# EAGLE design Esquematico (EAGLE 9.6.2)
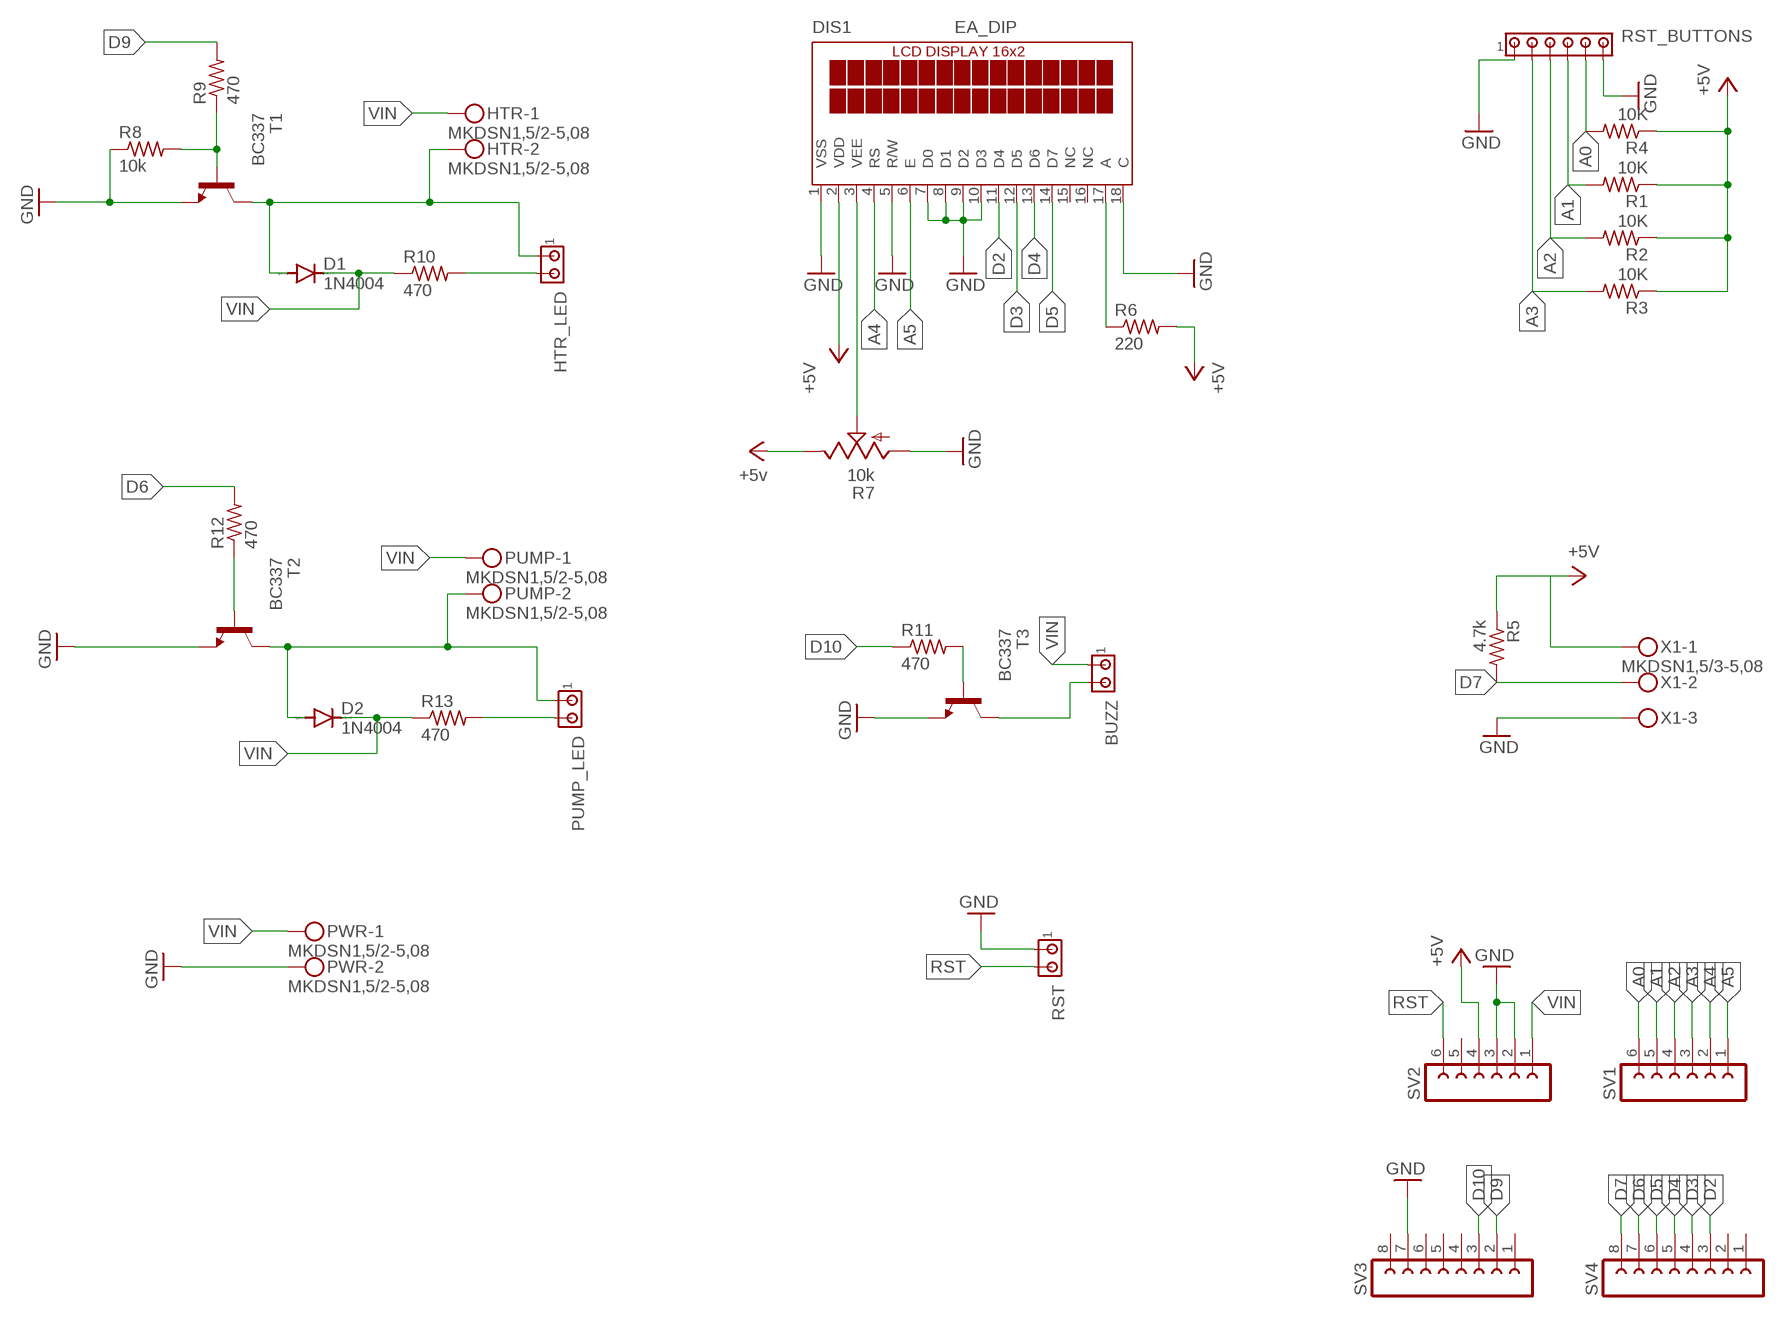
[diagram p0: schematic, sheet 1]

## Parts
BUZZ  MTA02-100  [10X02MTA]
D1  1N4004  [DO41-10]
D2  1N4004  [DO41-10]
DIS1  EA_DIP  [EA_DIP]
HTR  MKDSN1,5/2-5,08  [MKDSN1,5/2-5,08]
HTR_LED  MTA02-100  [10X02MTA]
PUMP  MKDSN1,5/2-5,08  [MKDSN1,5/2-5,08]
PUMP_LED  MTA02-100  [10X02MTA]
PWR  MKDSN1,5/2-5,08  [MKDSN1,5/2-5,08]
R1  10K  R-US_0204/5  [0204/5]
R2  10K  R-US_0204/5  [0204/5]
R3  10K  R-US_0204/5  [0204/5]
R4  10K  R-US_0204/5  [0204/5]
R5  4.7k  R-US_0204/5  [0204/5]
R6  220  R-US_0204/5  [0204/5]
R7  10k  TRIM_US-B25P  [B25P]
R8  10k  R-US_0204/5  [0204/5]
R9  470  R-US_0204/5  [0204/5]
R10  470  R-US_0204/5  [0204/5]
R11  470  R-US_0204/5  [0204/5]
R12  470  R-US_0204/5  [0204/5]
R13  470  R-US_0204/5  [0204/5]
RST  MTA02-100  [10X02MTA]
RST_BUTTONS  MTA06-100  [10X06MTA]
SV1  FE06-1  [FE06]
SV2  FE06-1  [FE06]
SV3  FE08-1  [FE08]
SV4  FE08-1  [FE08]
T1  BC337  [TO92]
T2  BC337  [TO92]
T3  BC337  [TO92]
X1  MKDSN1,5/3-5,08  [MKDSN1,5/3-5,08]

## Nets
A0: R4.2 RST_BUTTONS.5 SV1.6
A1: R1.2 RST_BUTTONS.4 SV1.5
A2: R2.2 RST_BUTTONS.3 SV1.4
A3: R3.2 RST_BUTTONS.2 SV1.3
A4: DIS1.4(RS) SV1.2
A5: DIS1.6(E) SV1.1
D2: DIS1.11(D4) SV4.3
D3: DIS1.12(D5) SV4.4
D4: DIS1.13(D6) SV4.5
D5: DIS1.14(D7) SV4.6
D6: R12.2 SV4.7
D7: R5.2 SV4.8 X1.2
D9: R9.2 SV3.2
D10: R11.1 SV3.3
GND: DIS1.1(VSS) DIS1.5(R/W) DIS1.7(D0) DIS1.8(D1) DIS1.9(D2) DIS1.10(D3) DIS1.18(C) PWR.2 R7.A R8.1 RST.1 RST_BUTTONS.1 RST_BUTTONS.6 SV2.2 SV2.3 SV3.7 T1.1(E) T2.1(E) T3.1(E) X1.3
N$1: DIS1.3(VEE) R7.S
N$2: R12.1 T2.2(B)
N$3: R8.2 R9.1 T1.2(B)
N$4: DIS1.17(A) R6.1
N$5: D1.A HTR.2 HTR_LED.1 T1.3(C)
N$6: HTR_LED.2 R10.2
N$7: D2.A PUMP.2 PUMP_LED.1 T2.3(C)
N$8: PUMP_LED.2 R13.2
N$9: R11.2 T3.2(B)
N$10: BUZZ.2 T3.3(C)
RST: RST.2 SV2.6
VCC: DIS1.2(VDD) R1.1 R2.1 R3.1 R4.1 R5.1 R6.2 R7.E SV2.4 X1.1 ; supply symbol labelled +5V, +5v
VIN: BUZZ.1 D1.C D2.C HTR.1 PUMP.1 PWR.1 R10.1 R13.1 SV2.1
Unconnected: DIS1.15(NC) DIS1.16(NC) SV2.5 SV3.1 SV3.4 SV3.5 SV3.6 SV3.8 SV4.1 SV4.2

## Library data of the parts
BUZZ HTR_LED PUMP_LED RST = con-amp:MTA02-100: AMP connector
D1 D2 = diode:1N4004: DIODE general purpose rectifier, 1 A
DIS1 = display-lcd:EA_DIP: LCD-MODUL 2x16 - 6,68mm, INKL. KONTROLLER HD44780 Source: Data sheet <http://www.lcd-module.de/pdf/doma/dip162-d.pdf>
HTR PUMP PWR = con-phoenix-508:MKDSN1,5/2-5,08: MKDSN 1,5/ 2-5,08 Printklemme Nennstrom: 13,5 A Nennspannung: 250 V Rastermaß: 5,08 mm Polzahl: 2 Anschlussart: Schraubanschluss Montage: Löten Anschlussrichtung Leiter/Platine: 0 ° Artikelnummer: 1729128 Source: http://eshop.phoenixcontact.com .. 1729128.pdf
R1-R6 R8-R13 = rcl:R-US_: RESISTOR, American symbol; SPICEPREFIX: R
R7 = pot:TRIM_US-: POTENTIOMETER
RST_BUTTONS = con-amp:MTA06-100: AMP connector Connection corrected 2014-09-19
SV1 SV2 = con-lsta:FE06-1: FEMALE HEADER; OC_FARNELL: unknown; OC_NEWARK: unknown
SV3 SV4 = con-lsta:FE08-1: FEMALE HEADER; OC_FARNELL: unknown; OC_NEWARK: unknown
T1-T3 = transistor:BC337: NPN TRANSISTOR
X1 = con-phoenix-508:MKDSN1,5/3-5,08: MKDSN 1,5/ 3-5,08 Printklemme Nennstrom: 13,5 A Nennspannung: 250 V Rastermaß: 5,08 mm Polzahl: 3 Anschlussart: Schraubanschluss Montage: Löten Anschlussrichtung Leiter/Platine: 0 ° Artikelnummer: 1729131 Source: http://eshop.phoenixcontact.com .. 1729131.pdf

## Board
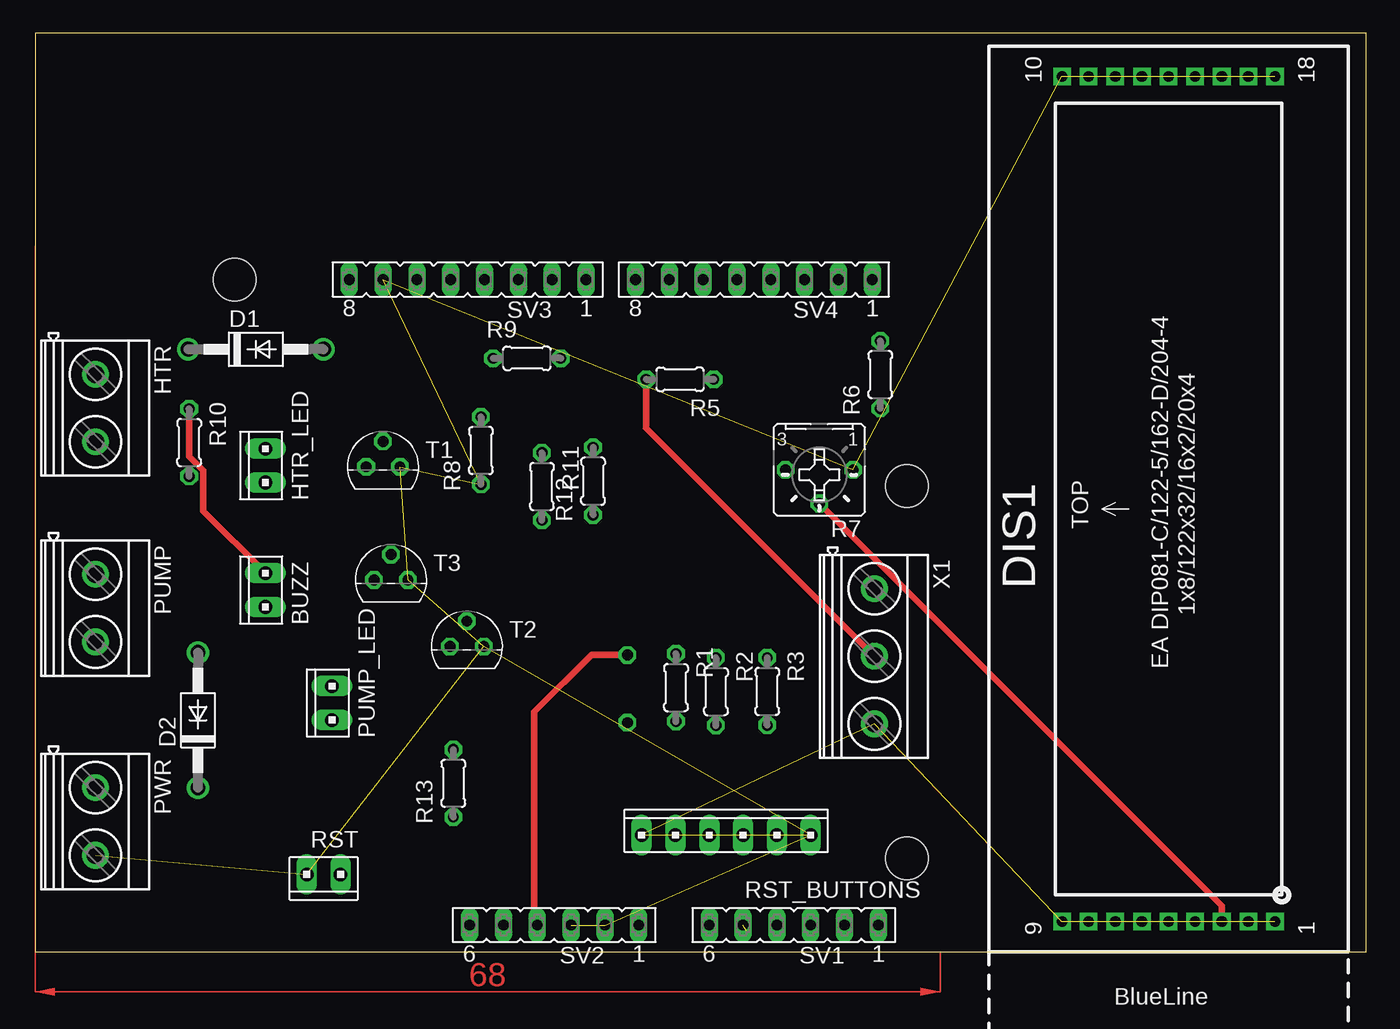
[diagram p1: board, top side]
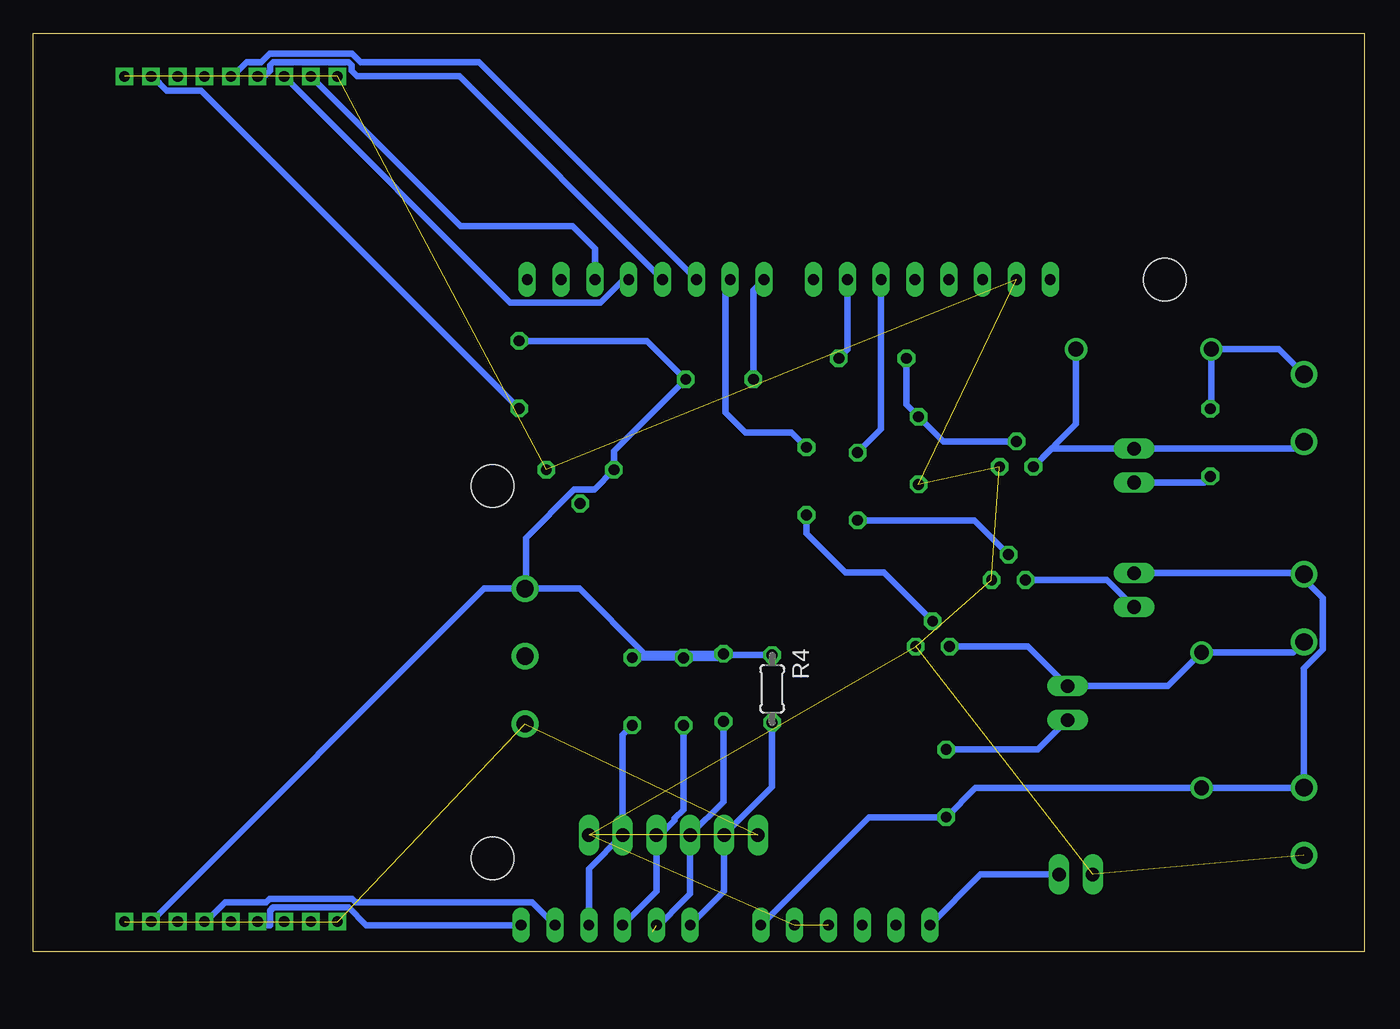
[diagram p2: board, bottom side, seen from below]

Size 100 x 69 mm. Coordinates in mm from the lower left corner, seen from the top.
Outline: 0,0 100,0 100,69 0,69 0,0
Copper layers (1*16): Top 0.035mm / dielectric 1.5mm / Bottom 0.035mm
Design rules "default": minimum track width 6mil, minimum drill 0.35mm, track to track 6mil, track to pad 6mil, pad to pad 6mil, via to via 6mil, smd to smd 6mil, copper to edge 40mil, drill to drill 6mil, minimum pad ring 10mil, minimum via ring 8mil, stop-mask expansion 4mil, vias tented up to drill 0mil, thermal gap 10mil
Holes 3.2 mm at 15,50.5 65.5,7 65.5,35

### Footprints (pad centres in the part's own frame; a part is rotated, then mirrored left to right if it is on the bottom)
10X02MTA = drill 1.016 long: 1 1.27,0; 2 -1.27,0
DO41-10 = drill 1.118: A 5.08,0; C -5.08,0
EA_DIP = drill 0.813 pad 1.27 square: 1 0,0; 2 0,2; 3 0,4; 4 0,6; 5 0,8; 6 0,10; 7 0,12; 8 0,14; 9 0,16; 10 63.5,16; 11 63.5,14; 12 63.5,12; 13 63.5,10; 14 63.5,8; 15 63.5,6; 16 63.5,4; 17 63.5,2; 18 63.5,0
MKDSN1,5/2-5,08 = drill 1.3 pad 2: 1 -2.561,0.025; 2 2.519,0.025
0204/5 = drill 0.813 octagon: 1 -2.54,0; 2 2.54,0
B25P = drill 0.813 octagon: A -2.54,0; E 2.54,0; S 0,2.54
10X06MTA = drill 1.016 long: 1 6.35,0; 2 3.81,0; 3 1.27,0; 4 -1.27,0; 5 -3.81,0; 6 -6.35,0
FE06 = drill 0.813 long: 1 -6.35,0; 2 -3.81,0; 3 -1.27,0; 4 1.27,0; 5 3.81,0; 6 6.35,0
FE08 = drill 0.813 long: 1 -8.89,0; 2 -6.35,0; 3 -3.81,0; 4 -1.27,0; 5 1.27,0; 6 3.81,0; 7 6.35,0; 8 8.89,0
TO92 = drill 0.813 octagon: 1 1.27,0; 2 0,1.905; 3 -1.27,0
MKDSN1,5/3-5,08 = drill 1.3 pad 2: 1 -7.641,0.025; 2 -2.561,0.025; 3 2.519,0.025

### Placement (x,y rotation side)
BUZZ  17.31,27.17 90 top
D1  16.59,45.26 0 top
D2  12.24,17.39 90 top
DIS1  93.15,2.26 90 top
HTR  4.52,40.82 270 top
HTR_LED  17.31,36.52 90 top
PUMP  4.52,25.79 270 top
PUMP_LED  22.31,18.68 90 top
PWR  4.52,9.76 270 top
R1  48.15,19.84 270 top
R2  51.15,19.54 270 top
R3  55,19.55 270 top
R4  44.5,19.75 270 bottom
R5  48.45,43 180 top
R6  63.5,43.35 90 top
R7  58.92,36.21 180 top
R8  33.5,37.65 90 top
R9  36.95,44.58 0 top
R10  11.58,38.25 270 top
R11  38.08,34.95 270 top
R12  41.92,35.35 90 top
R13  31.42,12.65 90 top
RST  21.68,5.81 180 top
RST_BUTTONS  51.92,8.76 0 top
SV1  57,2 180 top
SV2  39,2 180 top
SV3  32.5,50.5 180 top
SV4  54,50.5 180 top
T1  26.14,36.43 0 top
T2  32.44,22.93 0 top
T3  26.74,27.93 0 top
X1  63.03,19.63 270 top

### Tracks (layer width: path | path; a pad name or v marks a point on that pad's centre or on a via)
A0
  Bottom 0.5: SV1.6 48.11,4.54 RST_BUTTONS.5 44.5,12.37 R4.2
A1  (1 unrouted)
  Bottom 0.5: 53.5,1.5 50.65,4.35 RST_BUTTONS.4 48.15,11.26 R1.2
A2
  Bottom 0.5: RST_BUTTONS.3 53.19,8.5 | 53.19,8.5 53.19,4.54 SV1.4 | R2.2 51.15,10.67 51.81,10 51.81,9.88 53.19,8.5
A3
  Bottom 0.5: SV1.3 58.27,6.22 RST_BUTTONS.2 55.73,16.28 R3.2
A4
  Bottom 0.5: DIS1.4 87.04,2.26 85.58,3.72 82.5,3.72 82.25,3.98 76.05,3.98 75.8,3.72 62.53,3.72 SV1.2
A5
  Bottom 0.5: DIS1.6 82.89,2 82.21,2 82.21,3.09 81.98,3.32 76.32,3.32 75,2 SV1.1
D2
  Bottom 0.5: DIS1.11 67.89,54.5 59.5,54.5 57.81,52.81 SV4.3
D3
  Bottom 0.5: SV4.4 55.65,50.5 57.37,48.78 64.17,48.78 DIS1.12
D4
  Bottom 0.5: SV4.5 67.99,65.76 75.68,65.76 76.09,66.17 76.09,66.59 76.32,66.82 81.98,66.82 82.21,66.59 82.21,66.17 82.62,65.76 DIS1.13
D5
  Bottom 0.5: DIS1.14 85.04,65.76 83.98,66.82 82.9,66.82 82.25,67.47 76.05,67.47 75.4,66.82 66.51,66.82 SV4.6
D6
  Bottom 0.5: R12.2 43.03,39 46.5,39 48,40.5 48,50.15 SV4.7
D7
  Top 0.5: R5.2 45.91,39.34 X1.2
  Bottom 0.5: R5.2 45.91,49.7 SV4.8
D9
  Bottom 0.5: SV3.2 38.85,45.22 R9.2
D10
  Bottom 0.5: SV3.3 36.31,39.26 R11.1
GND  (19 unrouted)
N$1
  Top 0.5: R7.S 89.15,3.44 DIS1.3
N$2
  Bottom 0.5: T2.2 36.1,28.5 39,28.5 41.92,31.42 R12.1
N$3
  Bottom 0.5: T1.2 31.64,38.34 R8.2 34.41,41.1 R9.1
N$4
  Bottom 0.5: R6.1 87.39,64.7 89.98,64.7 91.04,65.76 DIS1.17
N$5
  Bottom 0.5: D1.A 21.67,39.63 T1.3 23.51,37.79 HTR_LED.1 5.06,37.79 HTR.2
N$6
  Bottom 0.5: HTR_LED.2 12.04,35.25 R10.2
N$7
  Bottom 0.5: T2.3 25.29,22.93 PUMP_LED.1 14.76,19.95 D2.A 5.35,22.47 PUMP.2
N$8
  Bottom 0.5: R13.2 24.53,15.19 PUMP_LED.2
N$9
  Bottom 0.5: T3.2 29.32,32.41 R11.2
N$10
  Bottom 0.5: BUZZ.2 19.34,27.93 T3.3
RST
  Bottom 0.5: RST.2 28.84,5.81 SV2.6
VCC
  Top 0.5: R4.1 41.79,22.29 37.5,18 37.5,2.23 SV2.4
  Bottom 0.5: R1.1 48.06,22.29 R4.1 | 63,27.27 58.98,27.27 54.09,22.38 R1.1 | 63,27.27 X1.1 66.14,27.27 DIS1.2 | R3.1 R2.1 48.45,22.08 R1.1 | R6.2 53.88,45.89 R5.1 56.38,37.61 R7.E 57.86,34.73 59.36,34.73 63,31.09 63,27.27
VIN
  Top 0.5: R10.1 11.58,37.21 12.64,36.15 12.64,33.11 BUZZ.1
  Bottom 0.5: HTR.1 6.42,45.26 D1.C 11.51,40.86 R10.1 | SV2.1 37.24,10.11 R13.1 29.22,12.31 D2.C 12.23,12.32 PWR.1 4.54,21.29 3.14,22.69 3.14,26.58 5,28.44 | BUZZ.1 5,28.44 | 5,28.44 4.63,28.44 PUMP.1
(copper drawn outside any net)
  shapes: Top area x2